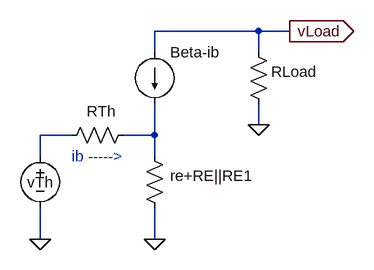
[diagram p0: schematic CE_small_signal_AC_equivalent.asc]
CE_small_signal_AC_equivalent.asc, the LTspice schematic file:
Version 4
SHEET 1 880 680
WIRE 528 -80 368 -80
WIRE 576 -80 528 -80
WIRE 368 -48 368 -80
WIRE 528 -48 528 -80
WIRE 528 64 528 32
WIRE 240 80 192 80
WIRE 368 80 368 32
WIRE 368 80 320 80
WIRE 192 112 192 80
WIRE 368 112 368 80
WIRE 192 240 192 192
WIRE 368 240 368 192
FLAG 192 240 0
FLAG 368 240 0
FLAG 528 64 0
FLAG 576 -80 vLoad
IOPIN 576 -80 Out
SYMBOL voltage 192 96 R0
WINDOW 0 -20 56 Left 2
SYMATTR InstName vTh
SYMATTR Value ""
SYMBOL res 352 96 R0
WINDOW 0 40 46 Left 2
SYMATTR InstName re+RE||RE1
SYMATTR Value ""
SYMBOL res 512 -64 R0
WINDOW 0 35 46 Left 2
SYMATTR InstName RLoad
SYMATTR Value ""
SYMBOL res 336 64 R90
WINDOW 0 -5 50 VBottom 2
WINDOW 3 32 56 VTop 2
SYMATTR InstName RTh
SYMATTR Value ""
SYMBOL current 368 -48 R0
SYMATTR InstName Beta-ib
SYMATTR Value ""
TEXT 240 112 Left 2 ;ib ----->

The netlist it stands for:
* CE_small_signal_AC_equivalent.asc
vTh N001 0
re+RE||RE1 N002 0
RLoad vLoad 0
RTh N002 N001
I§Beta-ib vLoad N002
* ib ----->
.backanno
.end